# EAGLE design TempCard (EAGLE 6.5.0)
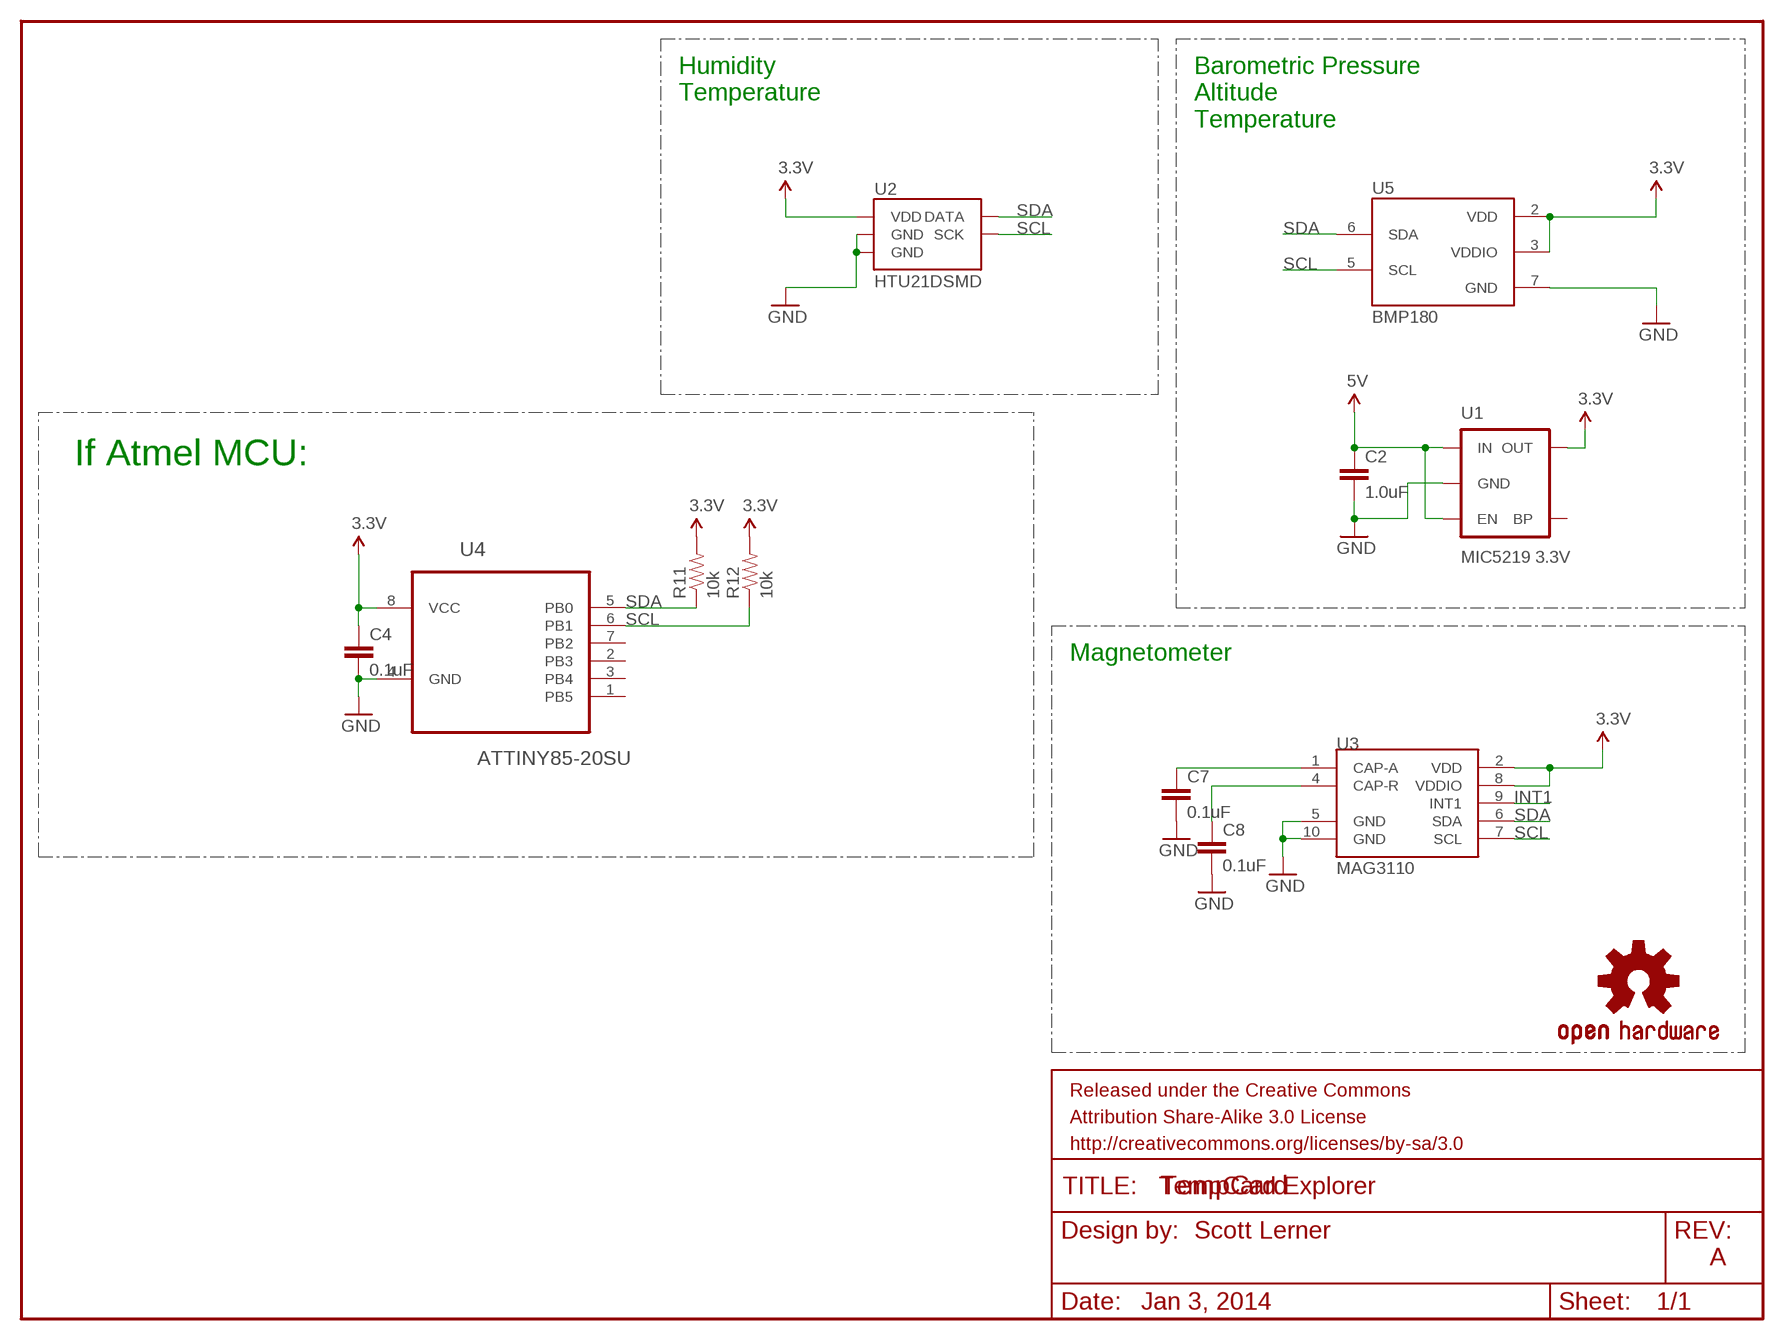
[diagram p0: schematic, sheet 1]

## Parts
C2  1.0uF  1.0UF-25V-+80/-20(0805)  [0805]
C4  0.1uF  1.0UF-25V-+80/-20(0805)  [0805]
C7  0.1uF  CAP0402-CAP  [0402-CAP]
C8  0.1uF  CAP0402-CAP  [0402-CAP]
FRAME1  FRAME-LETTER  [CREATIVE_COMMONS]
LOGO1  OSHW-LOGOM  [OSHW-LOGO-M]
R11  10k  RESISTOR0805-RES  [0805]
R12  10k  RESISTOR0805-RES  [0805]
U1  MIC5219 3.3V  V_REG_MIC52193.3V  [SOT23-5]
U2  HTU21DSMD  [HTU21D]
U3  MAG3110  [DFN-10]
U4  ATTINY85-20SU  [SOIC127P798X216-8N]
U5  BMP180  [BMP180]

## Nets
3.3V: C4.1 R11.2 R12.2 U1.5(OUT) U2.VDD U3.2(VDD) U3.8(VDDIO) U4.8(VCC) U5.2(VDD) U5.3(VDDIO)
5V: C2.1 U1.1(IN) U1.3(EN)
GND: C2.2 C4.2 C7.2 C8.2 U1.2(GND) U2.7(GND) U2.GND U3.5(GND) U3.10(GND) U4.4(GND) U5.7(GND)
INT1: U3.9(INT1)
N$12: C7.1 U3.1(CAP-A)
N$13: C8.1 U3.4(CAP-R)
SCL: R12.1 U3.7(SCL) U4.6(PB1)
SDA: R11.1 U3.6(SDA) U4.5(PB0)
Unconnected: U1.4(BP) U2.DATA U2.SCK U4.1(PB5) U4.2(PB3) U4.3(PB4) U4.7(PB2) U5.5(SCL) U5.6(SDA)

## Notes on the sheet
- Humidity
  Temperature
- Barometric Pressure
  Altitude
  Temperature
- If Atmel MCU:
- Magnetometer
- TempCard Explorer
- Scott Lerner
- A
- Jan 3, 2014

## Library data of the parts
C2 = SparkFun-Capacitors:1.0UF-25V-+80/-20(0805); PROD_ID: CAP-11625
C4 = SparkFun-Capacitors:1.0UF-25V-+80/-20(0805); PROD_ID: CAP-11625; VALUE: 1.0uF
C7 C8 = SparkFun-Passives:CAP: Capacitor Standard 0603 ceramic capacitor, and 0.1" leaded capacitor.
FRAME1 = SparkFun-Aesthetics:FRAME-LETTER: Schematic Frame Standard 8.5x11 US Letter frame
LOGO1 = SparkFun-Aesthetics:OSHW-LOGO: Open Source Hardware Logo This logo indicates the piece of hardware it is found on incorporates a OSHW license and/or adheres to the definition of open source hardware found here: http://freedomdefined.org/OSHW
R11 R12 = SparkFun-Resistors:RESISTOR: Resistor Basic schematic elements and footprints for 0603, 1206, and PTH resistors.
U1 = SparkFun-PowerIC:V_REG_MIC5219: V_REG MIC5219 Standard 500mA LDO voltage regulator in SOT-23 layout. Micrel part MIC5219. BP (by-pass) pin is used to lower output noise with 470pF cap, may be left open.; PROD_ID: VREG-09872
U2 = SparkFun-Sensors:HTU21D
U3 = SparkFun-Sensors:MAG3110: 3-axis digital (I2C) magnetometer
U4 = Atmel_By_element14_Batch_1:ATTINY85-20SU: 8-bit Microcontroller with In-System Programmable Flash; MPN: ATTINY85-20SU; OC_FARNELL: 1455164; OC_NEWARK: 58M3797; PACKAGE: SOIC-8; SUPPLIER: Atmel
U5 = SparkFun-Sensors:BMP180: BOSCH BMP180 DIGITAL BAROMETRIC PRESSURE SENSOR Web page: http://www.bosch-sensortec.com/en/homepage/products_3/environmental_sensors_1/bmp180_1/bmp180 Datasheet: http://ae-bst.resource.bosch.com/media/products/dokumente/bmp180/BST-BMP180-DS000-09.pdf The BMP180 is the function compatible successor of the BMP085, a new generation of high precision digital pressure sensors for consumer applications. The ultra-low power, low voltage electronics of the BMP180 is optimized for use in mobile phones, PDAs, GPS navigation devices and outdoor equipment. With a low altitude noise of merely 0.25m at fast conversion time, the BMP180 offers superior performance. The I2C interface allows for easy system integration with a microcontroller. The BMP180 is based on piezo-resistive technology for EMC robustness, high accuracy and linearity as well as long term stability. Key features: - Temperature measurement included - I2C interface - Fully calibrated - Pb-free, halogen-free and RoHS compliant, - MSL 1 Basic specs: Pressure range: 300 to 1100hPa (+9000m to -500m relating to sea level) Supply voltage: 1.8 to 3.6V (VDD), 1.62V to 3.6V (VDDIO) Package: LGA package with metal lid Small footprint: 3.6mm x 3.8mm Super-flat: 0.93mm height Low power: 5μA at 1 sample / sec. in standard mode Low noise: 0.06hPa (0.5m) in ultra low power mode, 0.02hPa (0.17m) advanced resolution mode Typical applications: - Enhancement of GPS navigation (dead-reckoning, slope detection, etc.) - In- and out-door navigation - Leisure and sports - Weather forecast - Vertical velocity indication (rise/sink speed)

## Board
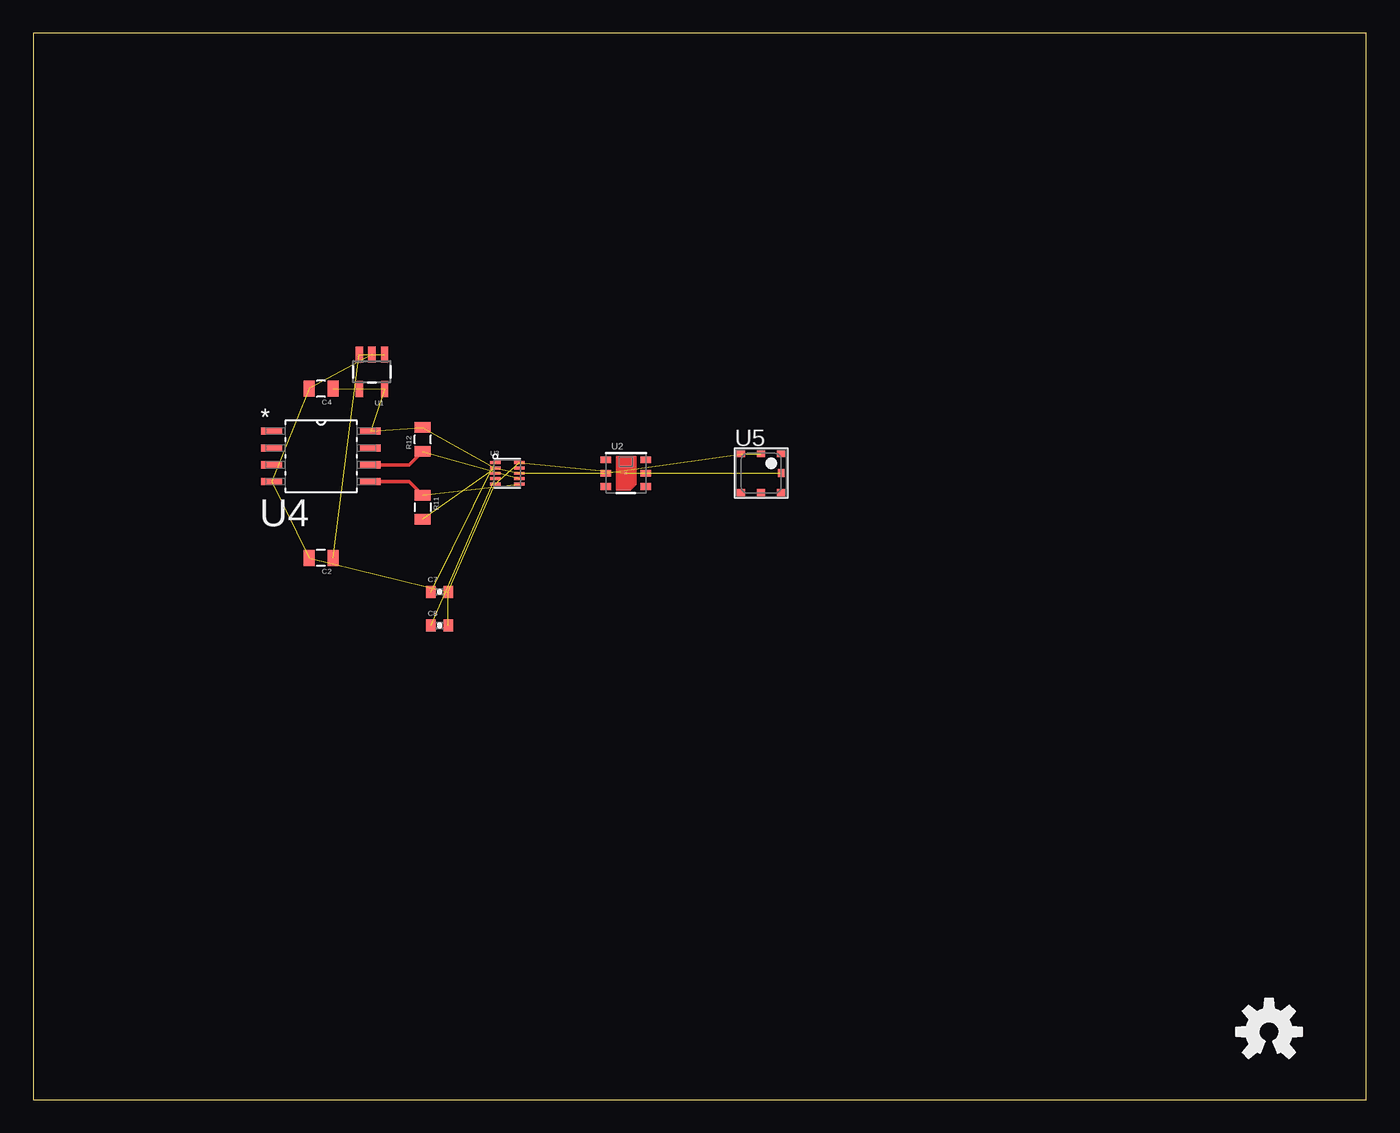
[diagram p1: board, top side]

Size 100 x 80 mm. Coordinates in mm from the lower left corner, seen from the top.
Outline: 0,0 100,0 100,80 0,80 0,0
Copper layers (1*16): Top 0.035mm / dielectric 1.5mm / Bottom 0.035mm
Design rules "default": minimum track width 10mil, minimum drill 24mil, track to track 8mil, track to pad 8mil, pad to pad 8mil, via to via 8mil, smd to smd 8mil, copper to edge 40mil, drill to drill 8mil, minimum pad ring 10mil, minimum via ring 8mil, stop-mask expansion 4mil, vias tented up to drill 0mil, thermal gap 10mil

### Footprints (pad centres in the part's own frame; a part is rotated, then mirrored left to right if it is on the bottom)
0805 = smd 0.8 x 1.2: 1 -0.9,0; 2 0.9,0
0402-CAP = smd 0.7 x 0.9: 1 -0.65,0; 2 0.65,0
SOT23-5 = smd 0.55 x 1.2: 1 -0.95,-1.3; 2 0,-1.3; 3 0.95,-1.3; 4 0.95,1.3; 5 -0.95,1.3
HTU21D = smd 0.2 x 0.2: 7 0,0 | smd 0.8 x 0.5: DATA 1.5,-1; GND 1.5,0; NC@1 -1.5,1; NC@6 1.5,1; SCK -1.5,-1; VDD -1.5,0
DFN-10 = smd 0.8 x 0.22: 1 -0.91,0.8; 2 -0.91,0.4; 3 -0.91,0; 4 -0.91,-0.4; 5 -0.91,-0.8; 6 0.91,-0.8; 7 0.91,-0.4; 8 0.91,0; 9 0.91,0.4; 10 0.91,0.8
SOIC127P798X216-8N = smd 1.549 x 0.533: 1 -3.708,1.905; 2 -3.708,0.635; 3 -3.708,-0.635; 4 -3.708,-1.905; 5 3.708,-1.905; 6 3.708,-0.635; 7 3.708,0.635; 8 3.708,1.905
BMP180 = smd 0.6 x 0.5: 1 1.5,1.45; 2 0,1.45; 3 -1.5,1.45; 4 -1.5,-1.45; 5 0,-1.45; 6 1.5,-1.45 | smd 0.5 x 0.6: 7 1.5,0

### Placement (x,y rotation side)
C2  21.59,40.64 180 top
C4  21.59,53.34 180 top
C7  30.48,38.1 0 top
C8  30.48,35.56 0 top
FRAME1  21.59,-7.62 0 top  (outside the outline)
LOGO1  92.71,5.08 0 top
R11  29.21,44.45 270 top
R12  29.21,49.53 90 top
U1  25.4,54.61 180 top
U2  44.45,46.99 0 top
U3  35.56,46.99 0 top
U4  21.59,48.26 0 top
U5  54.61,46.99 0 top

### Tracks (layer width: path | path; a pad name or v marks a point on that pad's centre or on a via)
3.3V  (9 unrouted)
5V  (2 unrouted)
GND  (10 unrouted)
N$12  (1 unrouted)
N$13  (1 unrouted)
SCL  (1 unrouted)
  Top 0.254: U4.6 28.2,47.62 R12.1
SDA  (1 unrouted)
  Top 0.254: U4.5 28.2,46.35 R11.1